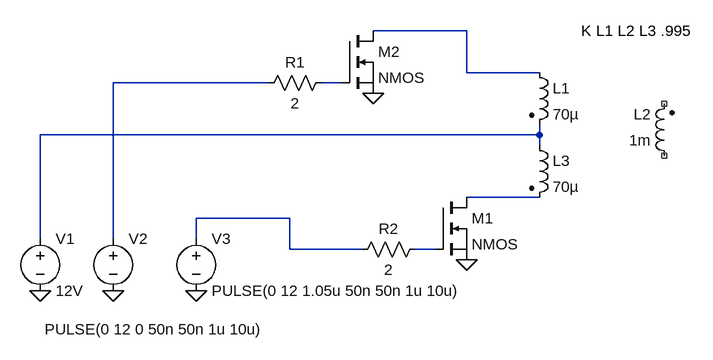
[diagram p0: schematic Push_pull_convetrer.asc]
Push_pull_convetrer.asc, the LTspice schematic file:
Version 4
SHEET 1 880 680
WIRE 384 -128 240 -128
WIRE 384 -64 384 -128
WIRE 496 -64 384 -64
WIRE 80 -48 -160 -48
WIRE 192 -48 160 -48
WIRE 496 32 496 16
WIRE 496 32 -272 32
WIRE 496 48 496 32
WIRE 496 128 384 128
WIRE 112 160 -32 160
WIRE -272 192 -272 32
WIRE -160 192 -160 -48
WIRE -32 192 -32 160
WIRE 112 208 112 160
WIRE 224 208 112 208
WIRE 336 208 304 208
FLAG -272 272 0
FLAG -160 272 0
FLAG -32 272 0
FLAG 240 -32 0
FLAG 384 224 0
SYMBOL voltage -272 176 R0
WINDOW 123 0 0 Left 2
WINDOW 39 0 0 Left 2
SYMATTR InstName V1
SYMATTR Value 12V
SYMBOL voltage -160 176 R0
WINDOW 3 -105 155 Left 2
WINDOW 123 0 0 Left 2
WINDOW 39 0 0 Left 2
SYMATTR InstName V2
SYMATTR Value PULSE(0 12 0 50n 50n 1u 10u)
SYMBOL voltage -32 176 R0
WINDOW 123 0 0 Left 2
WINDOW 39 0 0 Left 2
SYMATTR InstName V3
SYMATTR Value PULSE(0 12 1.05u 50n 50n 1u 10u)
SYMBOL ind2 480 -80 R0
SYMATTR InstName L1
SYMATTR Value 70µ
SYMATTR Type ind
SYMBOL ind2 704 80 R180
WINDOW 0 36 80 Left 2
WINDOW 3 36 40 Left 2
SYMATTR InstName L2
SYMATTR Value 1m
SYMATTR Type ind
SYMBOL ind2 480 32 R0
SYMATTR InstName L3
SYMATTR Value 70µ
SYMATTR Type ind
SYMBOL nmos 336 128 R0
SYMATTR InstName M1
SYMBOL nmos 192 -128 R0
SYMATTR InstName M2
SYMBOL res 176 -64 R90
WINDOW 0 0 56 VBottom 2
WINDOW 3 32 56 VTop 2
SYMATTR InstName R1
SYMATTR Value 2
SYMBOL res 320 192 R90
WINDOW 0 0 56 VBottom 2
WINDOW 3 32 56 VTop 2
SYMATTR InstName R2
SYMATTR Value 2
TEXT 560 -128 Left 2 !K L1 L2 L3 .995

The netlist it stands for:
* Push_pull_convetrer.asc
V1 N004 0 12V
V2 N002 0 PULSE(0 12 0 50n 50n 1u 10u)
V3 N006 0 PULSE(0 12 1.05u 50n 50n 1u 10u)
L1 N001 N004 70µ
L2 NC_01 NC_02 1m
L3 N004 N005 70µ
M1 N005 N007 0 0 NMOS
M2 N001 N003 0 0 NMOS
R1 N003 N002 2
R2 N007 N006 2
.model NMOS NMOS
.model PMOS PMOS
.lib standard.mos
K L1 L2 L3 .995
.backanno
.end